# Altium project PCB_Project1.PrjPCB
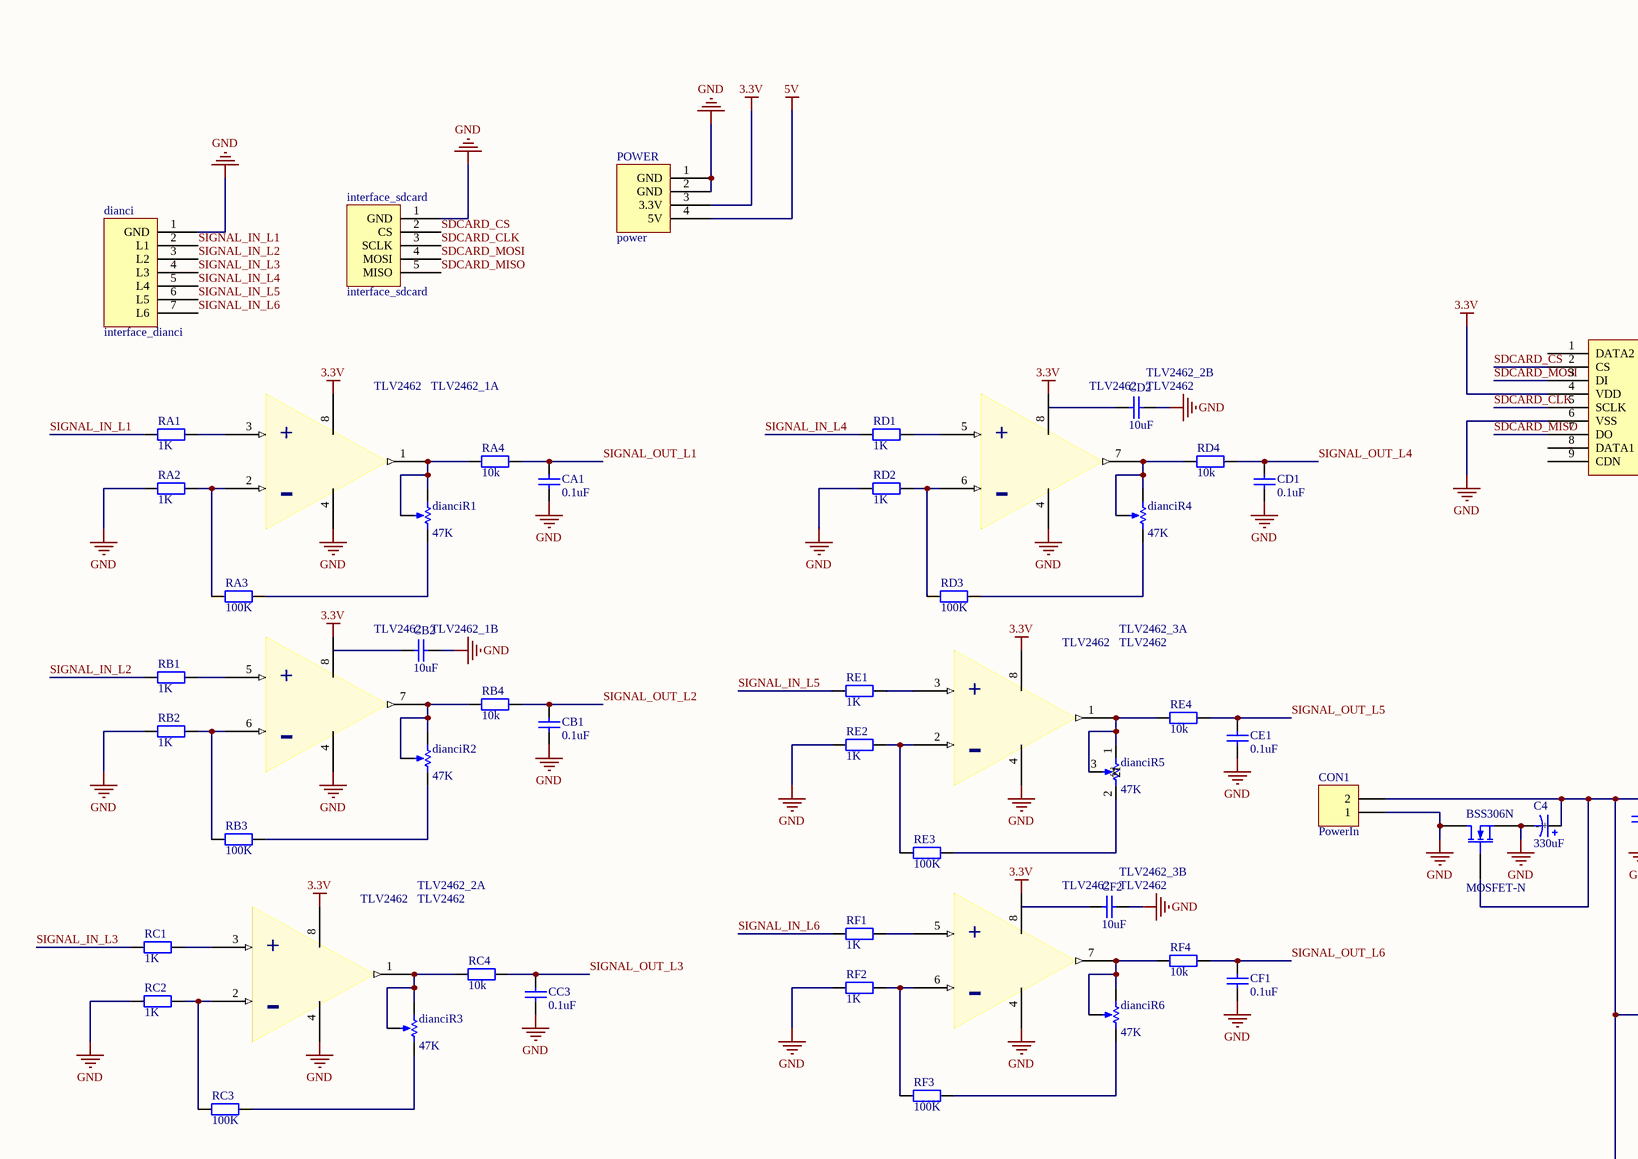
[diagram p0: control.SchDoc, top left]
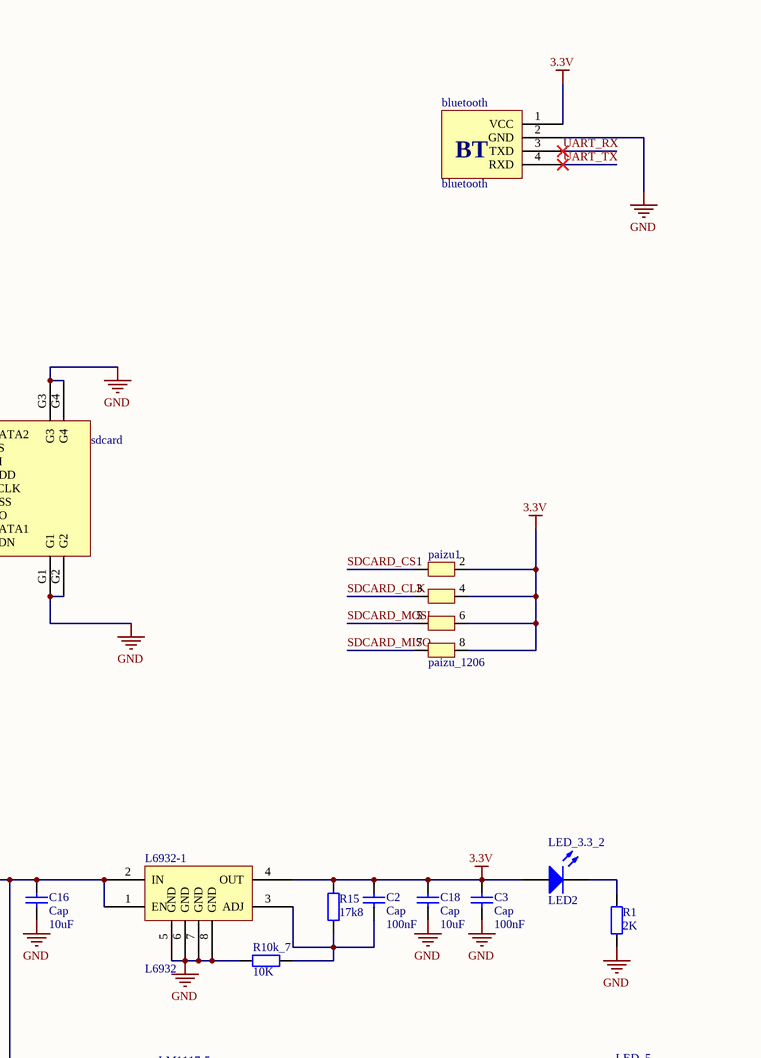
[diagram p1: control.SchDoc, top right]
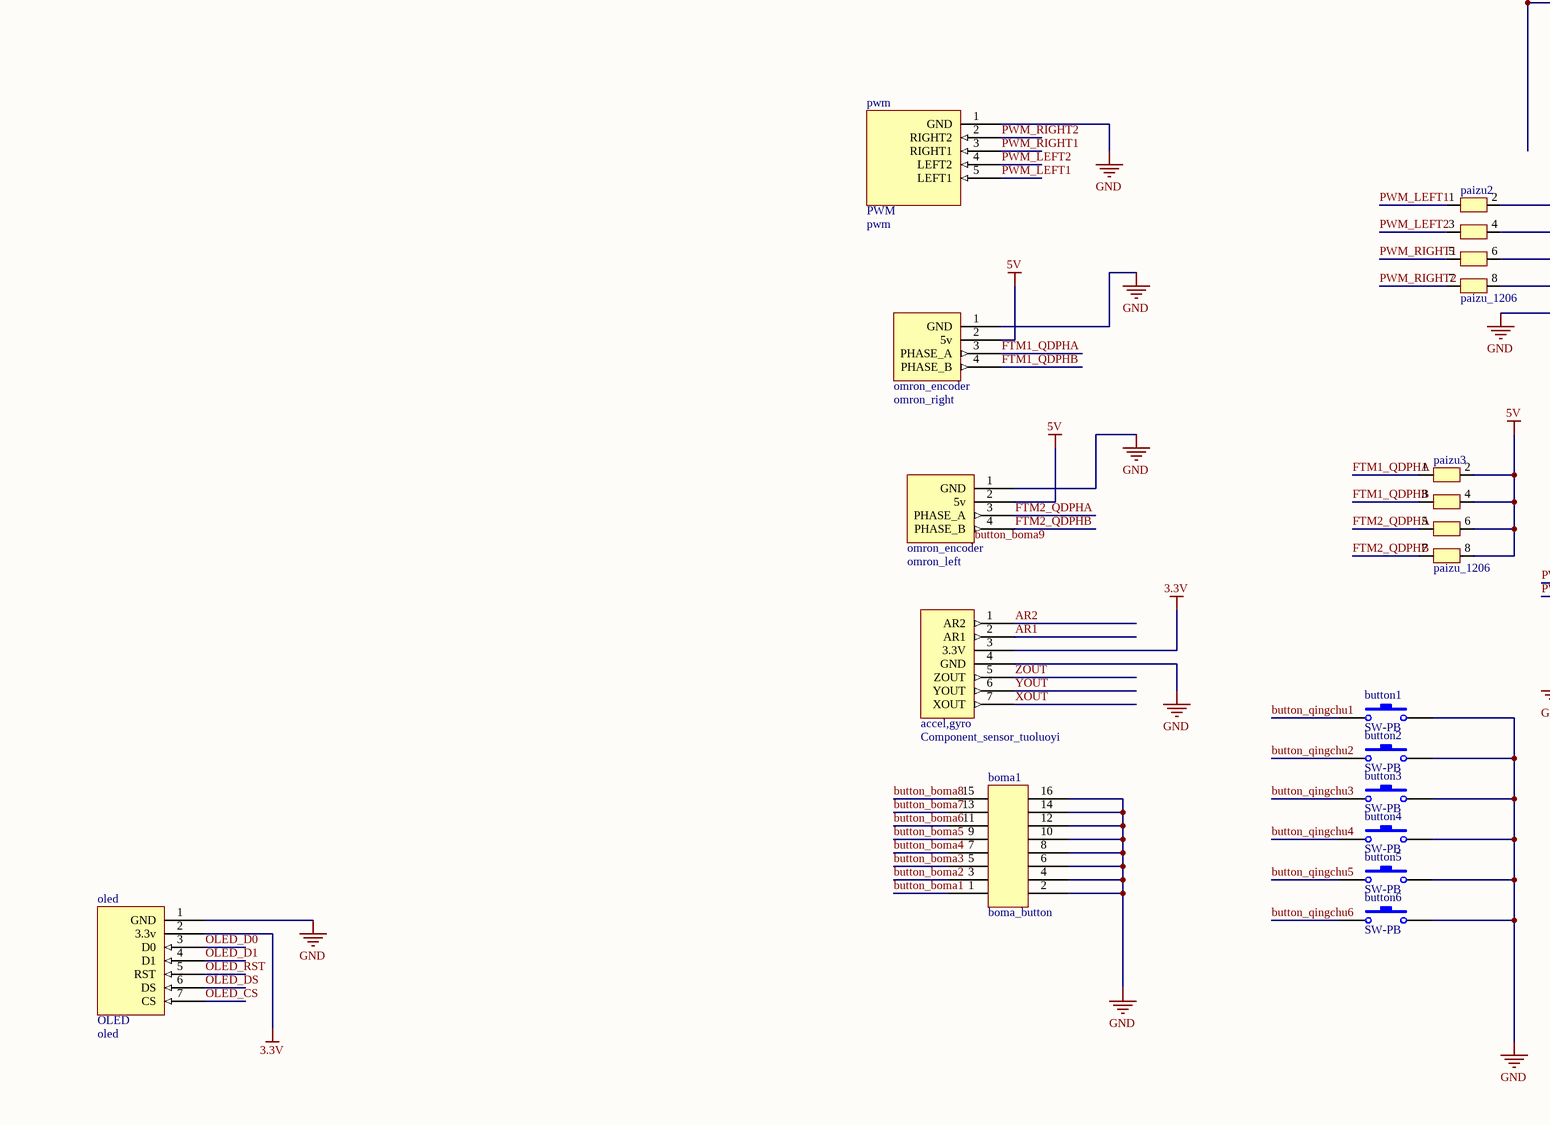
[diagram p2: control.SchDoc, bottom left]
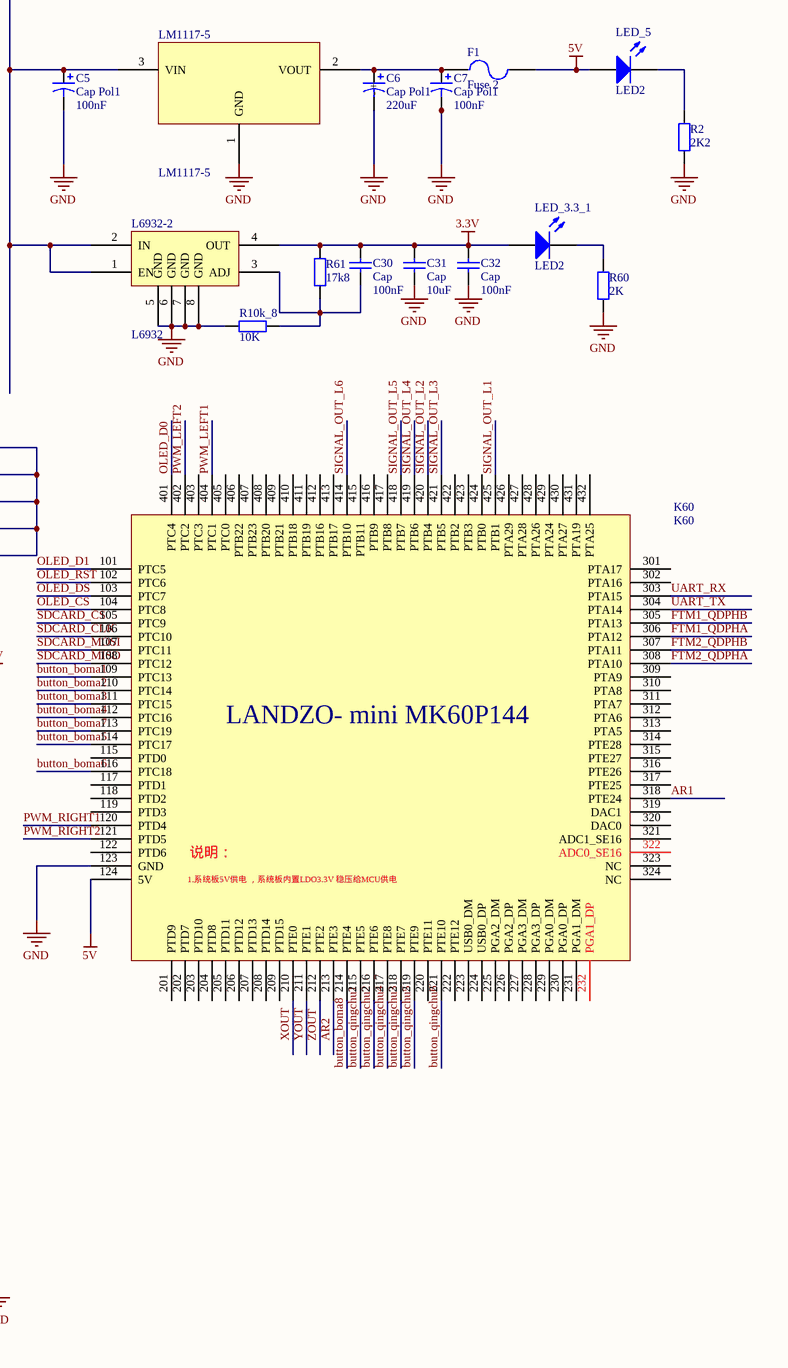
[diagram p3: control.SchDoc, bottom right]
1 sheet, 90 parts. Net scope: global (net labels, ports and power ports of the same name join across sheets).
Board file: PCB2.PcbDoc

## Sheet control.SchDoc
size 482 x 482 mm; PageSetup: Record=PageOptions|CenterHorizontal=True|CenterVertical=True|PrintScale=1.00|XCorrection=1.00|YCorrection=1.00|PrintKind=1|BorderSize=5000000|LeftOffset=0|BottomOffset=0|Orientation=2|PaperLength=1000|PaperWidth=1000|Scale=100|PaperSource=7|PrintQuality=-4|MediaType=1|DitherType=10|PaperKind=A6|PrintScaleMode=1

### Parts
bluetooth  bluetooth  [HDR1X4]
boma1  boma_button  [config_8]
BSS306N  MOSFET-N  [SOT-23_M]
button1  SW-PB  [button]
button2  SW-PB  [button]
button3  SW-PB  [button]
button4  SW-PB  [button]
button5  SW-PB  [button]
button6  SW-PB  [button]
C2  Cap  value 100nF  [0805]
C3  Cap  value 100nF  [0805]
C4  value 330uF  [RB5-10.5]  (hidden comment: Cap Pol1)
C5  Cap Pol1  value 100nF  [钽电容_小]
C6  Cap Pol1  value 220uF  [D7343]
C7  Cap Pol1  value 100nF  [钽电容_小]
C16  Cap  value 10uF  [0805]
C18  Cap  value 10uF  [0805]
C30  Cap  value 100nF  [0805]
C31  Cap  value 10uF  [0805]
C32  Cap  value 100nF  [0805]
CA1  value 0.1uF  [0805]  (hidden comment: Cap)
CB1  value 0.1uF  [0805]  (hidden comment: Cap)
CB2  value 10uF  [0805]  (hidden comment: Cap)
CC3  value 0.1uF  [0805]  (hidden comment: Cap)
CD1  value 0.1uF  [0805]  (hidden comment: Cap)
CD2  value 10uF  [0805]  (hidden comment: Cap)
CE1  value 0.1uF  [0805]  (hidden comment: Cap)
CF1  value 0.1uF  [0805]  (hidden comment: Cap)
CF2  value 10uF  [0805]  (hidden comment: Cap)
CON1  PowerIn  [接线端子]
dianci  interface_dianci  [HDR1X7H]
dianciR1  value 47K  [滑动变阻器]  (hidden comment: R4)
dianciR2  value 47K  [滑动变阻器]  (hidden comment: R4)
dianciR3  value 47K  [滑动变阻器]  (hidden comment: R4)
dianciR4  value 47K  [滑动变阻器]  (hidden comment: R4)
dianciR5  value 47K  [滑动变阻器]  (hidden comment: R4)
dianciR6  value 47K  [滑动变阻器]  (hidden comment: R4)
F1  Fuse 2  [0805]
interface_sdcard  interface_sdcard  [HDR1X5H]
K60  K60  [K60 V4.0最小系统版]
L6932-1  L6932  [L6932]
L6932-2  L6932  [L6932]
LED_3.3_1  LED2  [0805]
LED_3.3_2  LED2  [0805]
LED_5  LED2  [0805]
LM1117-5  LM1117-5  [SOT223_M]
oled  oled  [HDR1X7H]
omron_left  omron_encoder  [HDR1X4H]  (value not drawn)
omron_right  omron_encoder  [HDR1X4H]  (value not drawn)
paizu1  paizu_1206  [paizu]
paizu2  paizu_1206  [paizu]
paizu3  paizu_1206  [paizu]
POWER  power  [HDR1X4H]
pwm  pwm  [HDR1X5H]
R1  value 2K  [0805]  (hidden comment: Res2)
R2  value 2K2  [0805]  (hidden comment: Res2)
R10k_7  value 10K  [0805]  (hidden comment: Res2)
R10k_8  value 10K  [0805]  (hidden comment: Res2)
R15  value 17k8  [0805]  (hidden comment: Res2)
R60  value 2K  [0805]  (hidden comment: Res2)
R61  value 17k8  [0805]  (hidden comment: Res2)
RA1  value 1K  [0805]  (hidden comment: Res2)
RA2  value 1K  [0805]  (hidden comment: Res2)
RA3  value 100K  [0805]  (hidden comment: Res2)
RA4  value 10k  [0805]  (hidden comment: Res2)
RB1  value 1K  [0805]  (hidden comment: Res2)
RB2  value 1K  [0805]  (hidden comment: Res2)
RB3  value 100K  [0805]  (hidden comment: Res2)
RB4  value 10k  [0805]  (hidden comment: Res2)
RC1  value 1K  [0805]  (hidden comment: Res2)
RC2  value 1K  [0805]  (hidden comment: Res2)
RC3  value 100K  [0805]  (hidden comment: Res2)
RC4  value 10k  [0805]  (hidden comment: Res2)
RD1  value 1K  [0805]  (hidden comment: Res2)
RD2  value 1K  [0805]  (hidden comment: Res2)
RD3  value 100K  [0805]  (hidden comment: Res2)
RD4  value 10k  [0805]  (hidden comment: Res2)
RE1  value 1K  [0805]  (hidden comment: Res2)
RE2  value 1K  [0805]  (hidden comment: Res2)
RE3  value 100K  [0805]  (hidden comment: Res2)
RE4  value 10k  [0805]  (hidden comment: Res2)
RF1  value 1K  [0805]  (hidden comment: Res2)
RF2  value 1K  [0805]  (hidden comment: Res2)
RF3  value 100K  [0805]  (hidden comment: Res2)
RF4  value 10k  [0805]  (hidden comment: Res2)
sdcard  sdcard  [SDCARD-M]
TLV2462_1  TLV2462  [SOP127P600X175-8L]  (value not drawn)  (parts A,B of 2)
TLV2462_2  TLV2462  [SOP127P600X175-8L]  (parts A,B of 2)
TLV2462_3  TLV2462  [SOP127P600X175-8L]  (parts A,B of 2)
tuoluoyi  Component_sensor_tuoluoyi  [HDR1X7H]

### Nets
3.3V: bluetooth.1(VCC) C2.2 C3.2 C18.2 C30.2 C31.2 C32.2 L6932-1.4(OUT) L6932-2.4(OUT) LED_3.3_1.1(A) LED_3.3_2.1(A) oled.2(3.3v) paizu1.2 paizu1.4 paizu1.6 paizu1.8 POWER.3(3.3V) R15.2 R61.2 sdcard.4(VDD) TLV2462_1.8(VCC) TLV2462_2.8(VCC) TLV2462_3.8(VCC) tuoluoyi.3(3.3V)
5V: F1.2 K60.124(5V) LED_5.1(A) omron_left.2(5v) omron_right.2(5v) paizu3.2 paizu3.4 paizu3.6 paizu3.8 POWER.4(5V)
GND: bluetooth.2(GND) boma1.2 boma1.4 boma1.6 boma1.8 boma1.10 boma1.12 boma1.14 boma1.16 BSS306N.1(D) BSS306N.3(S) button1.2 button2.2 button3.2 button4.2 button5.2 button6.2 C3.1 C4.2(+) C5.2 C6.2(+) C7.2 C16.1 C18.1 C31.1 C32.1 CA1.1 CB1.1 CB2.2 CC3.1 CD1.1 CD2.2 CE1.1 CF1.1 CF2.2 CON1.1 dianci.1(GND) interface_sdcard.1(GND) K60.123(GND) L6932-1.5(GND) L6932-1.6(GND) L6932-1.7(GND) L6932-1.8(GND) L6932-2.5(GND) L6932-2.6(GND) L6932-2.7(GND) L6932-2.8(GND) LM1117-5.1(GND) oled.1(GND) omron_left.1(GND) omron_right.1(GND) paizu2.2 paizu2.4 paizu2.6 paizu2.8 POWER.1(GND) POWER.2(GND) pwm.1(GND) R1.1 R2.1 R10k_7.1 R10k_8.1 R60.1 RA2.1 RB2.1 RC2.1 RD2.1 RE2.1 RF2.1 sdcard.6(VSS) sdcard.G1 sdcard.G2 sdcard.G3 sdcard.G4 TLV2462_1.4(GND) TLV2462_2.4(GND) TLV2462_3.4(GND) tuoluoyi.4(GND)
AR1: K60.318(PTE24) tuoluoyi.2(AR1)
AR2: K60.213(PTE3) tuoluoyi.1(AR2)
button_boma1: boma1.1 K60.109(PTC13)
button_boma2: boma1.3 K60.110(PTC14)
button_boma3: boma1.5 K60.111(PTC15)
button_boma4: boma1.7 K60.112(PTC16)
button_boma5: boma1.9 K60.114(PTC17)
button_boma6: boma1.11 K60.116(PTC18)
button_boma7: boma1.13 K60.113(PTC19)
button_boma8: boma1.15 K60.214(PTE4)
button_qingchu1: button1.1 K60.215(PTE5)
button_qingchu2: button2.1 K60.216(PTE6)
button_qingchu3: button3.1 K60.218(PTE7)
button_qingchu4: button4.1 K60.217(PTE8)
button_qingchu5: button5.1 K60.219(PTE9)
button_qingchu6: button6.1 K60.221(PTE10)
FTM1_QDPHA: K60.306(PTA12) omron_right.3(PHASE_A) paizu3.1
FTM1_QDPHB: K60.305(PTA13) omron_right.4(PHASE_B) paizu3.3
FTM2_QDPHA: K60.308(PTA10) omron_left.3(PHASE_A) paizu3.5
FTM2_QDPHB: K60.307(PTA11) omron_left.4(PHASE_B) paizu3.7
OLED_CS: K60.104(PTC8) oled.7(CS)
OLED_D0: K60.401(PTC4) oled.3(D0)
OLED_D1: K60.101(PTC5) oled.4(D1)
OLED_DS: K60.103(PTC7) oled.6(DS)
OLED_RST: K60.102(PTC6) oled.5(RST)
PWM_LEFT1: K60.404(PTC1) paizu2.1 pwm.5(LEFT1)
PWM_LEFT2: K60.402(PTC2) paizu2.3 pwm.4(LEFT2)
PWM_RIGHT1: K60.120(PTD4) paizu2.5 pwm.3(RIGHT1)
PWM_RIGHT2: K60.121(PTD5) paizu2.7 pwm.2(RIGHT2)
SDCARD_CLK: interface_sdcard.3(SCLK) K60.106(PTC10) paizu1.3 sdcard.5(SCLK)
SDCARD_CS: interface_sdcard.2(CS) K60.105(PTC9) paizu1.1 sdcard.2(CS)
SDCARD_MISO: interface_sdcard.5(MISO) K60.108(PTC12) paizu1.7 sdcard.7(DO)
SDCARD_MOSI: interface_sdcard.4(MOSI) K60.107(PTC11) paizu1.5 sdcard.3(DI)
SIGNAL_IN_L1: dianci.2(L1) RA1.1
SIGNAL_IN_L2: dianci.3(L2) RB1.1
SIGNAL_IN_L3: dianci.4(L3) RC1.1
SIGNAL_IN_L4: dianci.5(L4) RD1.1
SIGNAL_IN_L5: dianci.6(L5) RE1.1
SIGNAL_IN_L6: dianci.7(L6) RF1.1
SIGNAL_OUT_L1: CA1.2 K60.425(PTB1) RA4.2
SIGNAL_OUT_L2: CB1.2 K60.420(PTB4) RB4.2
SIGNAL_OUT_L3: CC3.2 K60.421(PTB5) RC4.2
SIGNAL_OUT_L4: CD1.2 K60.419(PTB6) RD4.2
SIGNAL_OUT_L5: CE1.2 K60.418(PTB7) RE4.2
SIGNAL_OUT_L6: CF1.2 K60.414(PTB10) RF4.2
UART_RX: bluetooth.3(TXD) K60.303(PTA15)
UART_TX: bluetooth.4(RXD) K60.304(PTA14)
XOUT: K60.210(PTE0) tuoluoyi.7(XOUT)
YOUT: K60.211(PTE1) tuoluoyi.6(YOUT)
ZOUT: K60.212(PTE2) tuoluoyi.5(ZOUT)
NetBSS306N_2: BSS306N.2(G) C4.1(-) C5.1 C16.2 CON1.2 L6932-1.1(EN) L6932-1.2(IN) L6932-2.1(EN) L6932-2.2(IN) LM1117-5.3(VIN)
NetC2_1: C2.1 L6932-1.3(ADJ) R10k_7.2 R15.1
NetC6_1: C6.1(-) C7.1 F1.1 LM1117-5.2(VOUT)
NetC30_1: C30.1 L6932-2.3(ADJ) R10k_8.2 R61.1
NetdianciR1_1: dianciR1.1(TOP) dianciR1.3(TAP) RA4.1 TLV2462_1.1
NetdianciR1_2: dianciR1.2(BOT) RA3.2
NetdianciR2_1: dianciR2.1(TOP) dianciR2.3(TAP) RB4.1 TLV2462_1.7
NetdianciR2_2: dianciR2.2(BOT) RB3.2
NetdianciR3_1: dianciR3.1(TOP) dianciR3.3(TAP) RC4.1 TLV2462_2.1
NetdianciR3_2: dianciR3.2(BOT) RC3.2
NetdianciR4_1: dianciR4.1(TOP) dianciR4.3(TAP) RD4.1 TLV2462_2.7
NetdianciR4_2: dianciR4.2(BOT) RD3.2
NetdianciR5_1: dianciR5.1 dianciR5.3 RE4.1 TLV2462_3.1
NetdianciR5_2: dianciR5.2 RE3.2
NetdianciR6_1: dianciR6.1(TOP) dianciR6.3(TAP) RF4.1 TLV2462_3.7
NetdianciR6_2: dianciR6.2(BOT) RF3.2
NetLED_3.3_1_2: LED_3.3_1.2(K) R60.2
NetLED_3.3_2_2: LED_3.3_2.2(K) R1.2
NetLED_5_2: LED_5.2(K) R2.2
NetRA1_2: RA1.2 TLV2462_1.3
NetRA2_2: RA2.2 RA3.1 TLV2462_1.2
NetRB1_2: RB1.2 TLV2462_1.5
NetRB2_2: RB2.2 RB3.1 TLV2462_1.6
NetRC1_2: RC1.2 TLV2462_2.3
NetRC2_2: RC2.2 RC3.1 TLV2462_2.2
NetRD1_2: RD1.2 TLV2462_2.5
NetRD2_2: RD2.2 RD3.1 TLV2462_2.6
NetRE1_2: RE1.2 TLV2462_3.3
NetRE2_2: RE2.2 RE3.1 TLV2462_3.2
NetRF1_2: RF1.2 TLV2462_3.5
NetRF2_2: RF2.2 RF3.1 TLV2462_3.6

Not connected (* = marked no-connect by the designer): CB2 1; CD2 1; CF2 1; K60 115(PTD0) 117(PTD1) 118(PTD2) 119(PTD3) 122(PTD6) 201(PTD9) 202(PTD7) 203(PTD10) 204(PTD8) 205(PTD11) 206(PTD12) 207(PTD13) 208(PTD14) 209(PTD15) 220(PTE11) 222(PTE12) 223(USB0_DM) 224(USB0_DP) 225(PGA2_DM) 226(PGA2_DP) 227(PGA3_DM) 228(PGA3_DP) 229(PGA0_DM) 230(PGA0_DP) 231(PGA1_DM) 232(PGA1_DP) 301(PTA17) 302(PTA16) 309(PTA9) 310(PTA8) 311(PTA7) 312(PTA6) 313(PTA5) 314(PTE28) 315(PTE27) 316(PTE26) 317(PTE25) 319(DAC1) 320(DAC0) 321(ADC1_SE16) 322(ADC0_SE16) 323(NC) 324(NC) 403(PTC3) 405(PTC0) 406(PTB22) 407(PTB23) 408(PTB20) 409(PTB21) 410(PTB18) 411(PTB19) 412(PTB16) 413(PTB17) 415(PTB11) 416(PTB9) 417(PTB8) 422(PTB2) 423(PTB3) 424(PTB0) 426(PTA29) 427(PTA28) 428(PTA26) 429(PTA24) 430(PTA27) 431(PTA19) 432(PTA25); sdcard 1(DATA2) 8(DATA1) 9(CDN)

### Notes on the sheet
- Labels drawn without touching a wire or pin: button_boma9
- (in symbol bluetooth) BT
- (in symbol Component_1) LANDZO- mini MK60P144; 说明：; 1.系统板5V供电 ，系统板内置LDO3.3V 稳压给MCU供电
- (in symbol Component_sensor_tuoluoyi) accel,gyro
- (in symbol oled) OLED
- (in symbol pwm) PWM
- (in symbol TLV2462, part A) +; -
- (in symbol TLV2462, part B) +; -

### Library data of the parts
BSS306N = MOSFET-N: N-Channel MOSFET; Published: 8-Jun-2000; LatestRevisionDate: 17-Jul-2002; LatestRevisionNote: Re-released for DXP Platform.; PackageVersion: 1995/1996; PackageReference: E3; Publisher: Altium Limited; PackageDescription: TO, Flat Index; 3 In-Line, Axial Leads; Body Dia. 4.6mm; Lead Dia. 0.5 mm (max)
button1-button6 = SW-PB: Switch; Published: 24-Mar-1999; LatestRevisionDate: 17-Jul-2002; LatestRevisionNote: Re-released for DXP Platform.; PackageReference: SPST-2; Publisher: Altium Limited; PackageDescription: Switch; 2 Leads
C2 C3 C16 C18 C30-C32 CA1 CB1 CB2 CC3 CD1 CD2 CE1 CF1 CF2 = Cap: Capacitor; Published: 8-Jun-2000; LatestRevisionDate: 17-Jul-2002; LatestRevisionNote: Re-released for DXP Platform.; PackageReference: RAD-0.3; Publisher: Altium Limited; PackageDescription: Radial Cap, Thru-Hole; 2 Leads; 0.3 in Pin Spacing
C4 = Cap Pol1: Polarized Capacitor (Radial); Published: 8-Jun-2000; LatestRevisionDate: 17-Jul-2002; LatestRevisionNote: Re-released for DXP Platform.; PackageReference: RB7.6-15; Publisher: Altium Limited; PackageDescription: Polarized Capacitor (Radial); 2 Leads
C5-C7 = Cap Pol1: Polarized Capacitor (Radial); pin to pad: 1>2 2>1; Published: 8-Jun-2000; LatestRevisionDate: 17-Jul-2002; LatestRevisionNote: Re-released for DXP Platform.; PackageReference: RB7.6-15; Publisher: Altium Limited; PackageDescription: Polarized Capacitor (Radial); 2 Leads
CON1 = Header 2: Header, 2-Pin; LatestRevisionDate: 17-Jul-2002; LatestRevisionNote: Re-released for DXP Platform.; Publisher: Altium Limited
dianciR1-dianciR6 = RPot: Potentiometer; Sim Note: Enter the Resistance value and the set point into parameter fields.; Set Position: 0.5; Published: 8-Jun-2000; LatestRevisionDate: 17-Jul-2002; LatestRevisionNote: Re-released for DXP Platform.; PackageReference: VR5; Publisher: Altium Limited; PackageDescription: Variable Resistor, Thru-Hole; 3 Leads
F1 = Fuse 2: Fuse; Published: 8-Jun-2000; LatestRevisionDate: 17-Jul-2002; LatestRevisionNote: Re-released for DXP Platform.; PackageReference: PIN-W2/E2.8; Publisher: Altium Limited; PackageDescription: Thru-Hole; 2 Leads
K60 = Component_1
LED_3.3_1 LED_3.3_2 LED_5 = LED2: Typical RED, GREEN, YELLOW, AMBER GaAs LED; Published: 8-Jun-2000; LatestRevisionDate: 17-Jul-2002; LatestRevisionNote: Re-released for DXP Platform.; PackageVersion: Feb-2002; PackageReference: 3.2X1.6X1.1; Publisher: Altium Limited; PackageDescription: SM LED; 2 Flat Leads
R1 R2 R10k_7 R10k_8 R15 R60 R61 RA1-RA4 RB1-RB4 RC1-RC4 RD1-RD4 RE1-RE4 RF1-RF4 = Res2: Resistor; Published: 8-Jun-2000; LatestRevisionDate: 17-Jul-2002; LatestRevisionNote: Re-released for DXP Platform.; PackageReference: AXIAL-0.4; Publisher: Altium Limited; PackageDescription: Axial Device, Thru-Hole; 2 Leads; 0.4 in Pin Spacing
sdcard = sdcard: pin to pad: G1>10 G2>11 G3>12 G4>13